# Altium schematic sheet [7] SENSORS.SchDoc
size 431 x 279 mm; DocumentNumber: 8; SheetNumber: 8; SheetTotal: 9
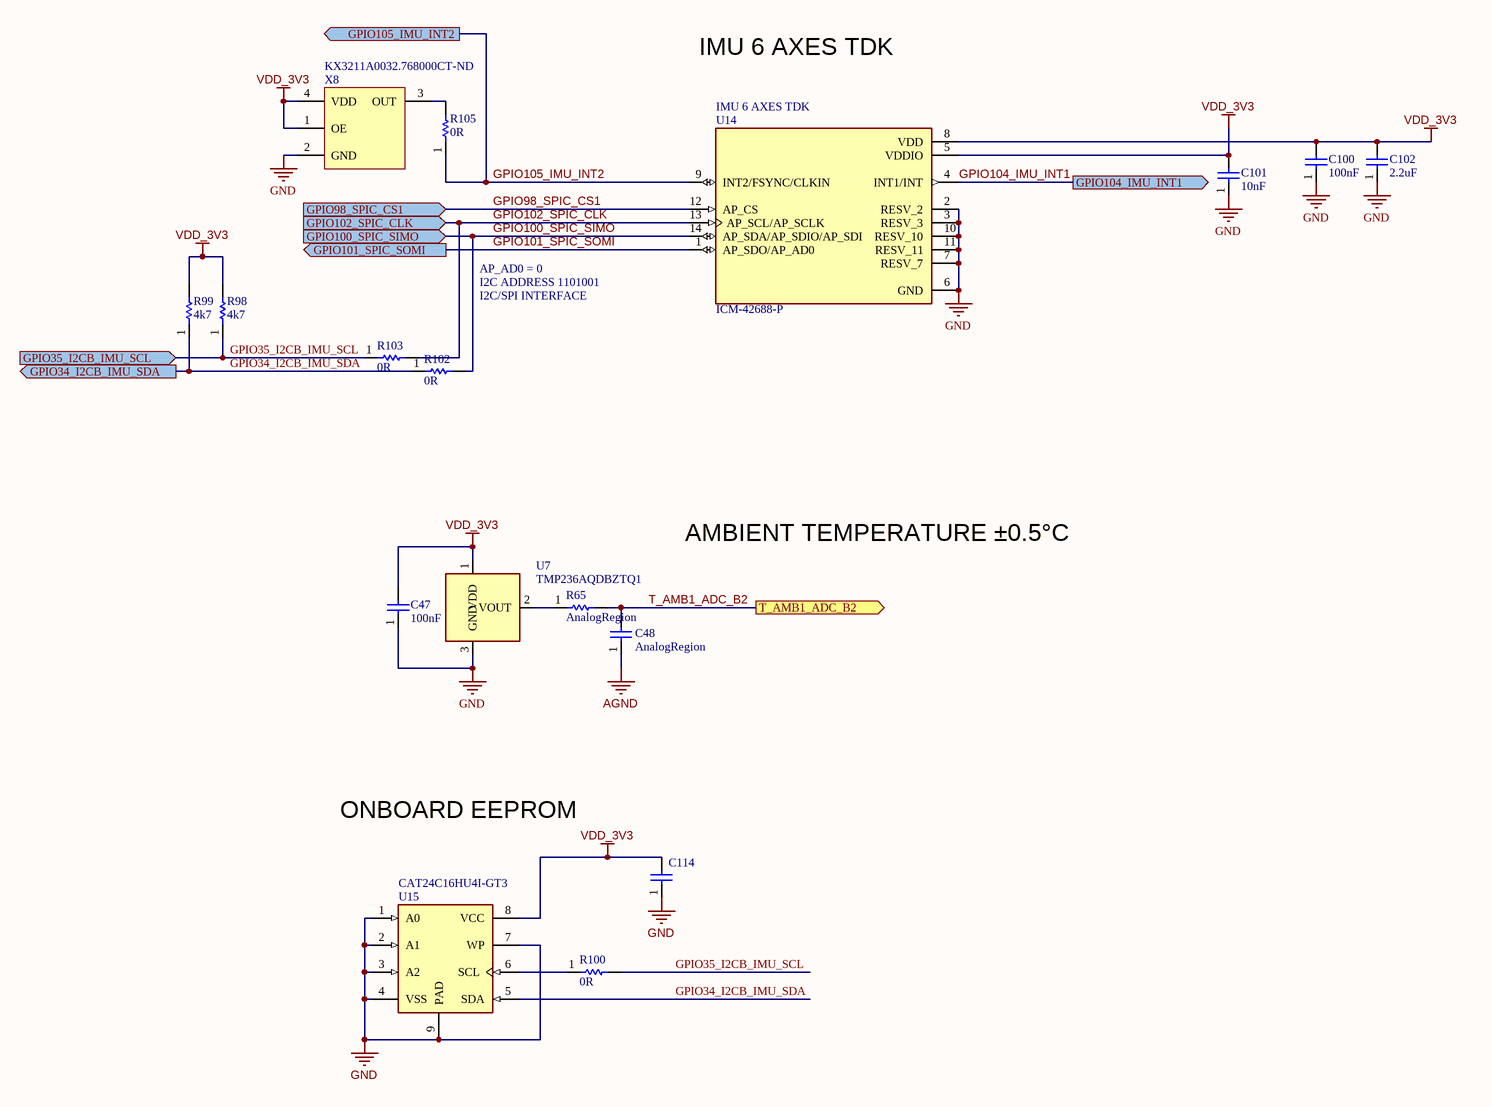
[diagram p0: [7] SENSORS.SchDoc]

## Parts
C47  value 100nF  [CAPC1005X03N(0402)]  (hidden comment: GRM155R71C104JA88D)
C48  ClassName: AnalogRegion  [CAPC1005X03N(0402)]  (hidden comment: GCM1555C1H471JA16D)
C100  value 100nF  [CAPC1005X03N(0402)]  (hidden comment: GRM155R71C104JA88D)
C101  value 10nF  [CAPC1005X03N(0402)]  (hidden comment: CC0402KRX7R9BB103)
C102  value 2.2uF  [CAPC1608X09N(0603)]  (hidden comment: GRM188R61A225KE34D)
C114  GRM155R71C104JA88D  [CAPC1005X03N(0402)]  (value not drawn)
R65  ClassName: AnalogRegion  [RESC1005X06N(0402)]  (hidden comment: CRCW0402220RFKED)
R98  value 4k7  [RESC1608X09N(0603)]  (hidden comment: CRCW06034K70FKEA)
R99  value 4k7  [RESC1608X09N(0603)]  (hidden comment: CRCW06034K70FKEA)
R100  value 0R  [RESC1608X09N(0603)]  (hidden comment: RC0603JR-070RL)
R102  value 0R  [0402]  (hidden comment: RCS04020000Z0ED)
R103  value 0R  [0402]  (hidden comment: RCS04020000Z0ED)
R105  value 0R  [0402]  (hidden comment: RCS04020000Z0ED)
U7  TMP236AQDBZTQ1  [SOT23]
U14  ICM-42688-P  [PQFN50P300X250X97-14N]
U15  CAT24C16HU4I-GT3  [UDFN8-EP]
X8  Supplier Part Number 1: KX3211A0032.768000CT-ND  [KX3211A0032.768000]  (hidden comment: 32.768Khz_OSC_KX3211A0032.768000)

## Ports
GPIO34_I2CB_IMU_SDA (out), GPIO35_I2CB_IMU_SCL (in), GPIO98_SPIC_CS1 (in), GPIO100_SPIC_SIMO (in), GPIO101_SPIC_SOMI (out), GPIO102_SPIC_CLK (in), GPIO104_IMU_INT1 (out), GPIO105_IMU_INT2 (out), T_AMB1_ADC_B2 (out)

## Nets
AGND: C48.1
GND: C47.1 C100.1 C101.1 C102.1 C114.1 U7.3(GND) U14.2(RESV_2) U14.3(RESV_3) U14.6(GND) U14.7(RESV_7) U14.10(RESV_10) U14.11(RESV_11) U15.1(A0) U15.2(A1) U15.3(A2) U15.4(VSS) U15.7(WP) U15.9(PAD) X8.2(GND)
VDD_3V3: C47.2 C100.2 C101.2 C102.2 C114.2 R98.2 R99.2 U7.1(VDD) U14.5(VDDIO) U14.8(VDD) U15.8(VCC) X8.1(OE) X8.4(VDD)
GPIO34_I2CB_IMU_SDA: R99.1 R102.1 U15.5(SDA) ; port GPIO34_I2CB_IMU_SDA
GPIO35_I2CB_IMU_SCL: R98.1 R100.2 R103.1 ; port GPIO35_I2CB_IMU_SCL
GPIO98_SPIC_CS1: U14.12(AP_CS) ; port GPIO98_SPIC_CS1
GPIO100_SPIC_SIMO: R102.2 U14.14(AP_SDA/AP_SDIO/AP_SDI) ; port GPIO100_SPIC_SIMO
GPIO101_SPIC_SOMI: U14.1(AP_SDO/AP_AD0) ; port GPIO101_SPIC_SOMI
GPIO102_SPIC_CLK: R103.2 U14.13(AP_SCL/AP_SCLK) ; port GPIO102_SPIC_CLK
GPIO104_IMU_INT1: U14.4(INT1/INT) ; port GPIO104_IMU_INT1
GPIO105_IMU_INT2: R105.1 U14.9(INT2/FSYNC/CLKIN) ; port GPIO105_IMU_INT2
T_AMB1_ADC_B2: C48.2 R65.2 ; port T_AMB1_ADC_B2
NetR65_1: R65.1 U7.2(VOUT)
NetR100_1: R100.1 U15.6(SCL)
NetR105_2: R105.2 X8.3(OUT)

## Notes on the sheet
- IMU 6 AXES TDK
- (near U14) IMU 6 AXES TDK
- AP_AD0 = 0
- I2C ADDRESS 1101001
- I2C/SPI INTERFACE
- AMBIENT TEMPERATURE ±0.5°C
- ONBOARD EEPROM
- REVISION
- DESCRIPTION
- DATE
- PROJECT:
- AUTHOR:
- TITLE:
- FILE NAME:
- CUR REV:
- PCB:
- SHEET:
- DATE:
- OF

## Library data of the parts
C47 C100 = 100nF_16V_0402_CAP: CAP CER 0.1UF 16V X7R 0402; Tolerance: 5%; MPN: GRM155R71C104JA88D; Voltage Rating: 16V; Temp Coeff: X7R; Size/Package: 0402
C48 = 470pF_50V_0402_CAP: CAP CER 470PF 50V C0G/NP0 0402; Tolerance: 5%; Temp Coeff: C0G, NP0; Voltage: 50V; MPN: GCM1555C1H471JA16D; Size: 0402; Parameter 1: *
C101 = 10nF_50V_0402_CAP: CAP CER 10000PF 50V X7R 0402; Tolerance: 10%; MPN: CC0402KRX7R9BB103; Voltage: 50V; Temp Coeff: X7R; Size/Package: 0402; Supplier 1: Digi-Key; Supplier Part Number 1: 311-1349-1-ND
C102 = 2.2uF_10V_0603_CAP: CAP CER 2.2UF 10V X5R 0603; Tolerance: 10%; MPN: GRM188R61A225KE34D; Voltage Rating: 10V; Temp Cofficient: X5R; Size: 0603; Supplier 1: Digikey; Supplier Part Number 1: 490-1545-1-ND
C114 = 100nF_16V_0402_CAP: CAP CER 0.1UF 16V X7R 0402; Value: 100nF; Tolerance: 5%; MPN: GRM155R71C104JA88D; Voltage Rating: 16V; Temp Coeff: X7R; Size/Package: 0402
R65 = 220_1/16W_0402_RES: RES SMD 220 OHM 1% 1/16W 0402; Tolerance: 1%.; Supplier 1: Digikey; Supplier Part Number 1: 541-220LCT-ND; MPN: CRCW0402220RFKED; Package: 0402; Wattage: 1/16W; Parameter 1: *
R98 R99 = 4k7_1/10W_0603_RES: RES SMD 4.7K OHM 1% 1/10W 0603; Wattage: 0.1W; MPN: CRCW06034K70FKEA; Drawn By: TC; Check By: *; Tolarance: 1%; Supplier 1: Digi-Key; Supplier Part Number 1: 541-4.70KHCT-ND
R100 = 0R_1/10W_0603_RES: RES SMD 0 OHM JUMPER 1/10W 0603; MPN: RC0603JR-070RL; Tolerance: Jumper; Power: 1/10W; Package/Case: 0603; Supplier 1: Digi-Key; Supplier Part Number 1: 311-0.0GRDKR-ND
R102 R103 R105 = 0R_1/5W_0402_RCS04020000Z0ED_RES: VISHAY - RCS04020000Z0ED - SMD Chip Resistor, 0402 [1005 Metric], 0 ohm, RCS Series, 50 V, Thick Film, 200 mW; Manufacturer: Vishay Dale; Resistance: 0mR; Max Power Dissipation: 200mW; Supplier 1: Digi-Key; Manufacturer Part Number: RCS04020000Z0ED; RoHS: Yes; Category: Chip SMD Resistors; Stock 1: 18214; Pricing 1: 1=0.10000, 10=0.08300, 25=0.05760, 50=0.04480, 100=0.03200, 250=0.02496, 500=0.01984, 1000=0.01408, 5000=0.01088 (USD); Case/Package: 0402; Case Code (Metric): 1005; Case Code (Imperial): 0402; Min Operating Temperature: -55°C; Max Operating Temperature: 155°C; Packaging: Tape and Reel; Resistor Type: Thick Film; Number of Terminations: 2; Features: Automotive AEC-Q200; Length: 0.039inch; Width: 0.02inch; Height: 0.016inch; RoHS Compliant: Yes; ComponentLink1URL: http://www.farnell.com/datasheets/2618474.pdf?src-supplier=Farnell; ComponentLink1Description: http://www.farnell.com/datasheets/2618474.pdf?src-supplier=Farnell; ComponentLink2URL: http://www.vishay.com/docs/20065/rcse3.pdf?src-supplier=Digi-Key; ComponentLink2Description: http://www.vishay.com/docs/20065/rcse3.pdf?src-supplier=Digi-Key; ComponentLink3URL: http://www.farnell.com/datasheets/2618474.pdf?src-supplier=Element14; ComponentLink3Description: http://www.farnell.com/datasheets/2618474.pdf?src-supplier=Element14; ComponentLink4URL: http://www.farnell.com/datasheets/2618474.pdf?src-supplier=Newark; ComponentLink4Description: http://www.farnell.com/datasheets/2618474.pdf?src-supplier=Newark; Supplier Part Number 1: 541-2877-1-ND
U7 = TMP236AQDBZTQ1_TEMP_SENSOR: TMP23x-Q1 Automotive Grade, High-Accuracy Analog Output Temperature Sensors; Manufacturer: Texas Instruments; Supplier 1: Digi-Key; Manufacturer Part Number: TMP236AQDBZTQ1; RoHS: Yes; Category: Integrated Circuits (ICs); Pricing 1: 1=0.91000, 5=0.86800, 10=0.75500, 25=0.66320, 50=0.55080, 100=0.46920 (USD); Supplier Part Number 1: 296-TMP236AQDBZTQ1DKR-ND
U14 = ICM-42688-P_IMU_6-axes: Accelerometer and Gyroscope 6-Axis MEMS Motion Tracking Device Digital-OUT 14-Pin LGA T/R; Manufacturer: TDK InvenSense; Supplier 1: Digi-Key; Manufacturer Part Number: ICM-42688-P; RoHS: Yes; Category: Inertial Measurement Units (IMUs); Pricing 1: 1=7,96000, 5=7,02000, 10=6,20100, 25=5,03120, 50=4,44600, 100=4,32900, 500=3,62700, 1000=3,39300 (USD); Supplier Part Number 1: 1428-ICM-42688-PCT-ND
U15 = CAT24C16HU4I-GT3_EEPROM_16Kb: EEPROM Serial-2Wire 16K-bit 2K x 8 1.8V/2.5V/3.3V/5V Automotive 8-Pin UDFN EP T/R; Manufacturer: ON Semiconductor; Interface: I2C,Serial,2-Wire; Frequency: 100kHz; Min Supply Voltage: 1.7V; Max Supply Voltage: 5.5V; Access Time: 900ns; Nominal Supply Current: 2mA; Density: 16Kb; Number of Words: 2000; Max Frequency: 400kHz; Organization: 2KX8; Write Protection: YES; Supplier 1: Digi-Key; Manufacturer Part Number: CAT24C16HU4I-GT3; RoHS: Yes; Category: EEPROM; Stock 1: 2625; Pricing 1: 1=0.41000, 10=0.40300, 25=0.37440, 50=0.37240, 100=0.33080, 250=0.32656, 500=0.32164, 1000=0.31304 (USD); Mount: Surface Mount; Number of Pins: 8; Contact Plating: Gold; Min Operating Temperature: -40°C; Max Operating Temperature: 85°C; Packaging: Tape and Reel; Memory Type: EEPROM; Package Quantity: 3000; Memory Size: 16Kb; Series: -; Access Time-Max: 900ns; Supply Current: 2mA; Length: 3.05mm; Width: 2.05mm; Height: 0.5mm; REACH SVHC: No SVHC; Lead Free: Lead Free; Halogen Free: Halogen Free; RoHS Compliant: Yes; ComponentLink1URL: https://datasheet.ciiva.com/22618/1696759-22618473.pdf?src-supplier=Element14; ComponentLink1Description: https://datasheet.ciiva.com/22618/1696759-22618473.pdf?src-supplier=Element14; Supplier Part Number 1: CAT24C16HU4I-GT3OSCT-ND
X8 = 32.768Khz_OSC_KX3211A0032.768000: SMD Crystal Oscillator 0.032768MHz 3.3V 15pF 4-Pin CSMD; Manufacturer: Diodes; Max Supply Current: 15uA; Frequency Stability: 20ppm; Supplier 1: Digi-Key; Manufacturer Part Number: KX3211A0032.768000; RoHS: Yes; Category: Oscillators; Stock 1: 5092; Pricing 1: 1=2.26000, 10=2.20500, 50=2.10000, 100=1.83750, 500=1.78500, 1000=1.52250 (USD); Mount: Surface Mount; Case/Package: SMD/SMT; Min Operating Temperature: -20°C; Max Operating Temperature: 70°C; Package Quantity: 100; Frequency: 32.768kHz; Packaging: Cut Strip; Length: 0.126inch; Width: 0.098inch; Height: 0.045inch; RoHS Compliant: Yes; ComponentLink1URL: https://www.diodes.com/assets/Datasheets/KX321.pdf?src-supplier=Digi-Key; ComponentLink1Description: https://www.diodes.com/assets/Datasheets/KX321.pdf?src-supplier=Digi-Key; ComponentLink2URL: https://www.pericom.com/assets/Datasheets/KX321.pdf?src-supplier=Digi-Key; ComponentLink2Description: https://www.pericom.com/assets/Datasheets/KX321.pdf?src-supplier=Digi-Key